# EAGLE design SLaB (EAGLE 9.6.1)
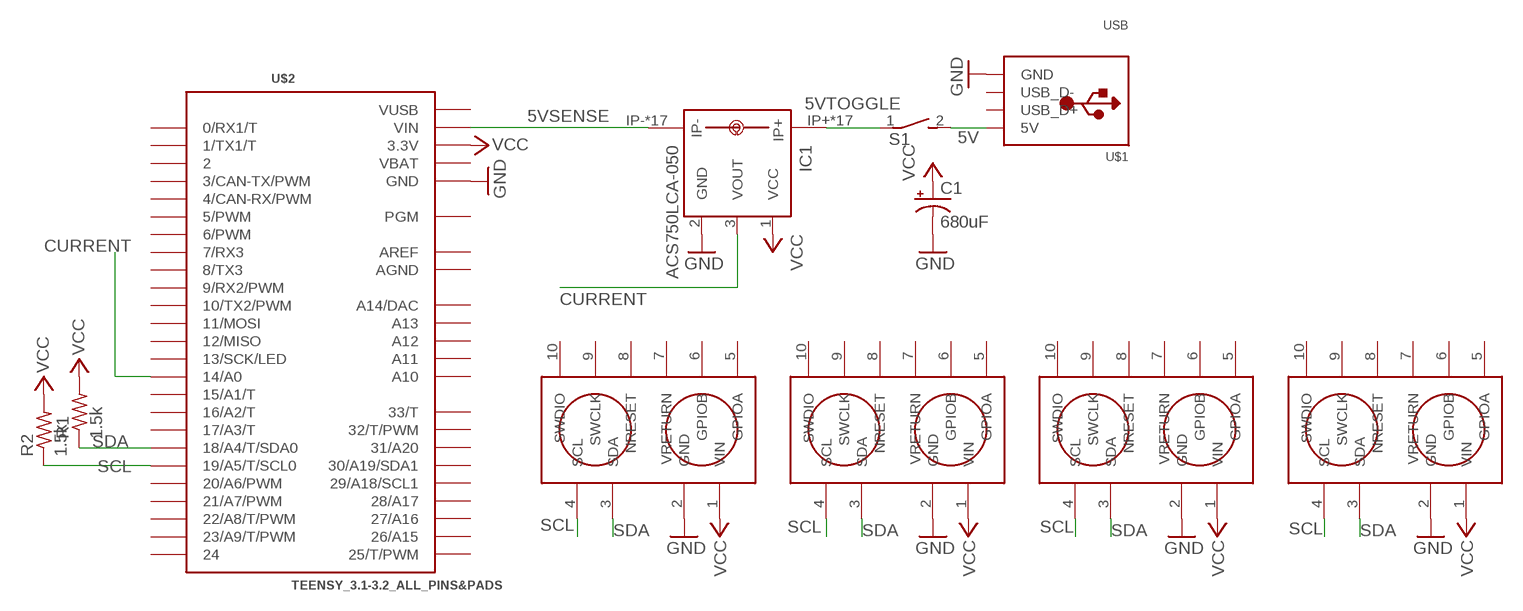
[diagram p0: schematic, sheet 1]

## Parts
C1  680uF  CPOL-USE2-5  [E2-5]
IC1  ACS750LCA-050  [ACS75050]
R1  1.5k  R-US_0204/7  [0204/7]
R2  1.5k  R-US_0204/7  [0204/7]
S1  DS01E  [DS-01]
U$1  USB  [USB]
U$2  TEENSY_3.1-3.2_ALL_PINS&PADS  [TEENSY_3.0-3.2_ALL_PINS_&_PADS]
U$3  LIDAR  [LIDAR]
U$4  LIDAR  [LIDAR]
U$5  LIDAR  [LIDAR]
U$6  LIDAR  [LIDAR]

## Nets
5V: S1.2 U$1.5V
5VSENSE: IC1.IP- IC1.IP-@2(IP-) IC1.IP-@3(IP-) IC1.IP-@4(IP-) IC1.IP-@5(IP-) IC1.IP-@6(IP-) IC1.IP-@7(IP-) IC1.IP-@8(IP-) IC1.IP-@9(IP-) IC1.IP-@10(IP-) IC1.IP-@11(IP-) IC1.IP-@12(IP-) IC1.IP-@13(IP-) IC1.IP-@14(IP-) IC1.IP-@15(IP-) IC1.IP-@16(IP-) IC1.IP-@17(IP-) U$2.VIN
5VTOGGLE: IC1.IP+ IC1.IP+@2(IP+) IC1.IP+@3(IP+) IC1.IP+@4(IP+) IC1.IP+@5(IP+) IC1.IP+@6(IP+) IC1.IP+@7(IP+) IC1.IP+@8(IP+) IC1.IP+@9(IP+) IC1.IP+@10(IP+) IC1.IP+@11(IP+) IC1.IP+@12(IP+) IC1.IP+@13(IP+) IC1.IP+@14(IP+) IC1.IP+@15(IP+) IC1.IP+@16(IP+) IC1.IP+@17(IP+) S1.1
CURRENT: IC1.3(VOUT) U$2.14/A0
GND: C1.- IC1.2(GND) U$1.GND U$2.GND U$2.GND1(GND) U$2.GND2(GND) U$3.2(GND) U$4.2(GND) U$5.2(GND) U$6.2(GND)
SCL: R2.1 U$2.19/A5(19/A5/T/SCL0) U$3.4(SCL) U$4.4(SCL) U$5.4(SCL) U$6.4(SCL)
SDA: R1.1 U$2.18/A4(18/A4/T/SDA0) U$3.3(SDA) U$4.3(SDA) U$5.3(SDA) U$6.3(SDA)
VCC: C1.+ IC1.1(VCC) R1.2 R2.2 U$2.3.3V U$2.3.3V1(3.3V) U$2.3.3V2(3.3V) U$3.1(VIN) U$4.1(VIN) U$5.1(VIN) U$6.1(VIN)
Unconnected: U$1.USB_D+ U$1.USB_D- U$2.0(0/RX1/T) U$2.1(1/TX1/T) U$2.2 U$2.3(3/CAN-TX/PWM) U$2.4(4/CAN-RX/PWM) U$2.5(5/PWM) U$2.6(6/PWM) U$2.7(7/RX3) U$2.8(8/TX3) U$2.9(9/RX2/PWM) U$2.10(10/TX2/PWM) U$2.11(11/MOSI) U$2.12(12/MISO) U$2.13(13/SCK/LED) U$2.15/A1(15/A1/T) U$2.16/A2(16/A2/T) U$2.17/A3(17/A3/T) U$2.20/A6(20/A6/PWM) U$2.21/A7(21/A7/PWM) U$2.22/A8(22/A8/T/PWM) U$2.23/A9(23/A9/T/PWM) U$2.24 U$2.25(25/T/PWM) U$2.26(26/A15) U$2.27(27/A16) U$2.28(28/A17) U$2.29(29/A18/SCL1) U$2.30(30/A19/SDA1) U$2.31(31/A20) U$2.32(32/T/PWM) U$2.33(33/T) U$2.A10 U$2.A11 U$2.A12 U$2.A13 U$2.PGM U$2.RESET/DAC(A14/DAC) U$3.5(GPIOA) U$3.6(GPIOB) U$3.7(VRETURN) U$3.8(NRESET) U$3.9(SWCLK) U$3.10(SWDIO) U$4.5(GPIOA) U$4.6(GPIOB) U$4.7(VRETURN) U$4.8(NRESET) U$4.9(SWCLK) U$4.10(SWDIO) U$5.5(GPIOA) U$5.6(GPIOB) U$5.7(VRETURN) U$5.8(NRESET) U$5.9(SWCLK) U$5.10(SWDIO) U$6.5(GPIOA) U$6.6(GPIOB) U$6.7(VRETURN) U$6.8(NRESET) U$6.9(SWCLK) U$6.10(SWDIO)

## Power pins joined to a net without a drawn wire
AGND: U$2.AGND
AREF: U$2.AREF
VBAT: U$2.VBAT
VUSB: U$2.VUSB

## Library data of the parts
C1 = adafruit:CPOL-US: POLARIZED CAPACITOR, American symbol
IC1 = allegro:ACS750*CA-050: Current Sensor display layer 49 Reference in BRD and place VIAs on circles Source: www.allegromicro.com/datafile/0750-050.pdf; MF: ALLEGRO MICROSYSTEMS, INC.; MPN: ACS750LCA-050; OC_FARNELL: 1457176; OC_NEWARK: 61H4464
R1 R2 = adafruit:R-US_: RESISTOR, American symbol
S1 = switch-dil:DS01E: DIL/CODE SWITCH; OC_FARNELL: unknown; OC_NEWARK: unknown
U$1 = USB:USB
U$2 = Teensy_3_and_LC_Series_Boards_v1.4:TEENSY_3.1-3.2_ALL_PINS&PADS: Footprint for Teensy 3.1 or 3.2 board using all pads and all through-holes. Pads need a 2x7 0.1" SMD header.
U$3-U$6 = LIDAR:LIDAR

## Board
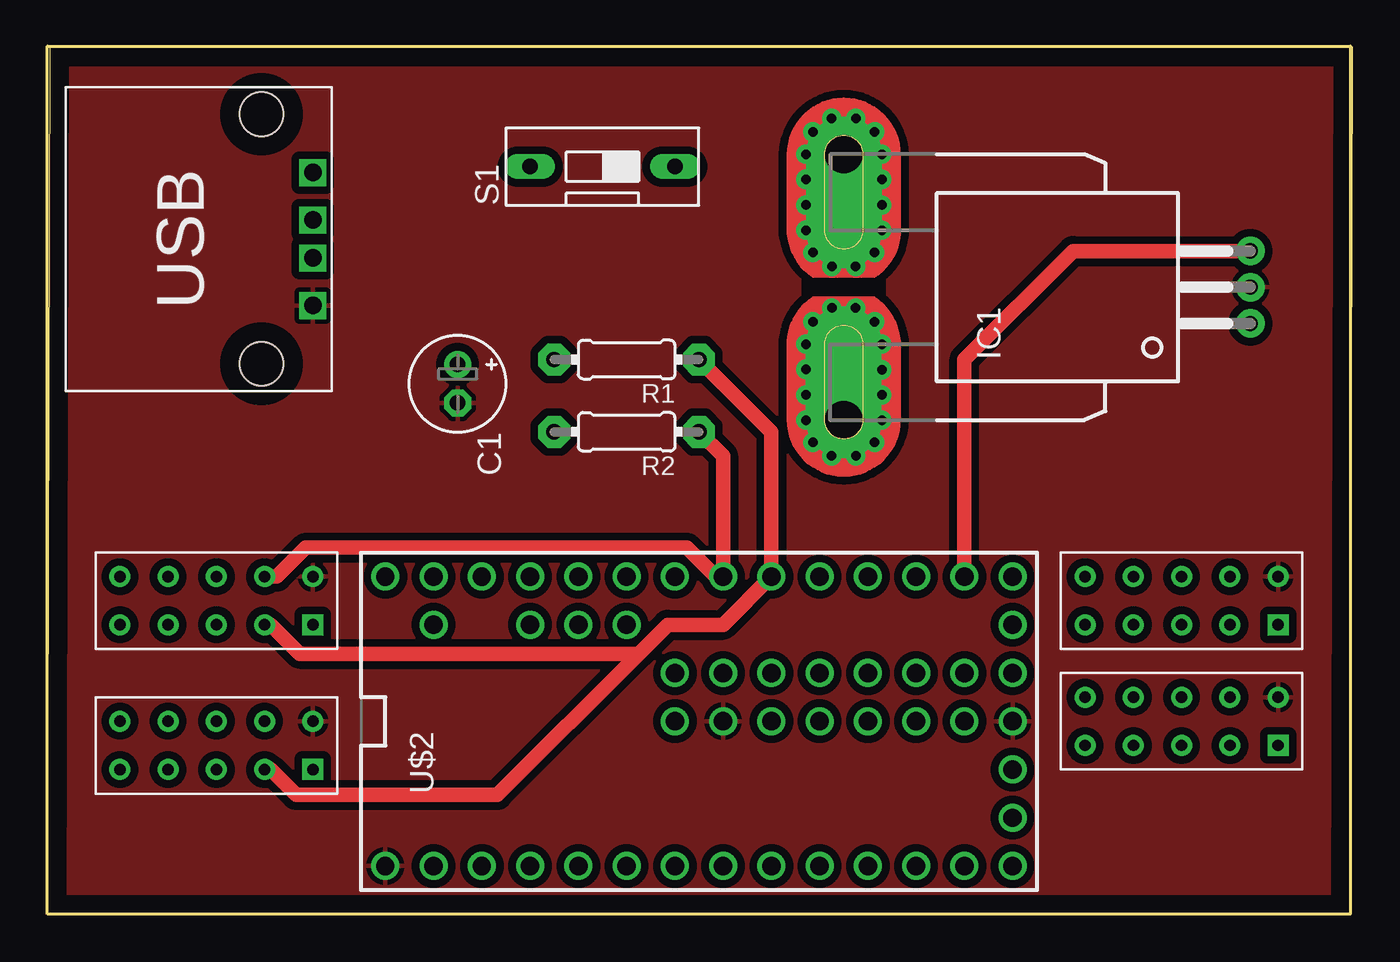
[diagram p1: board, top side]
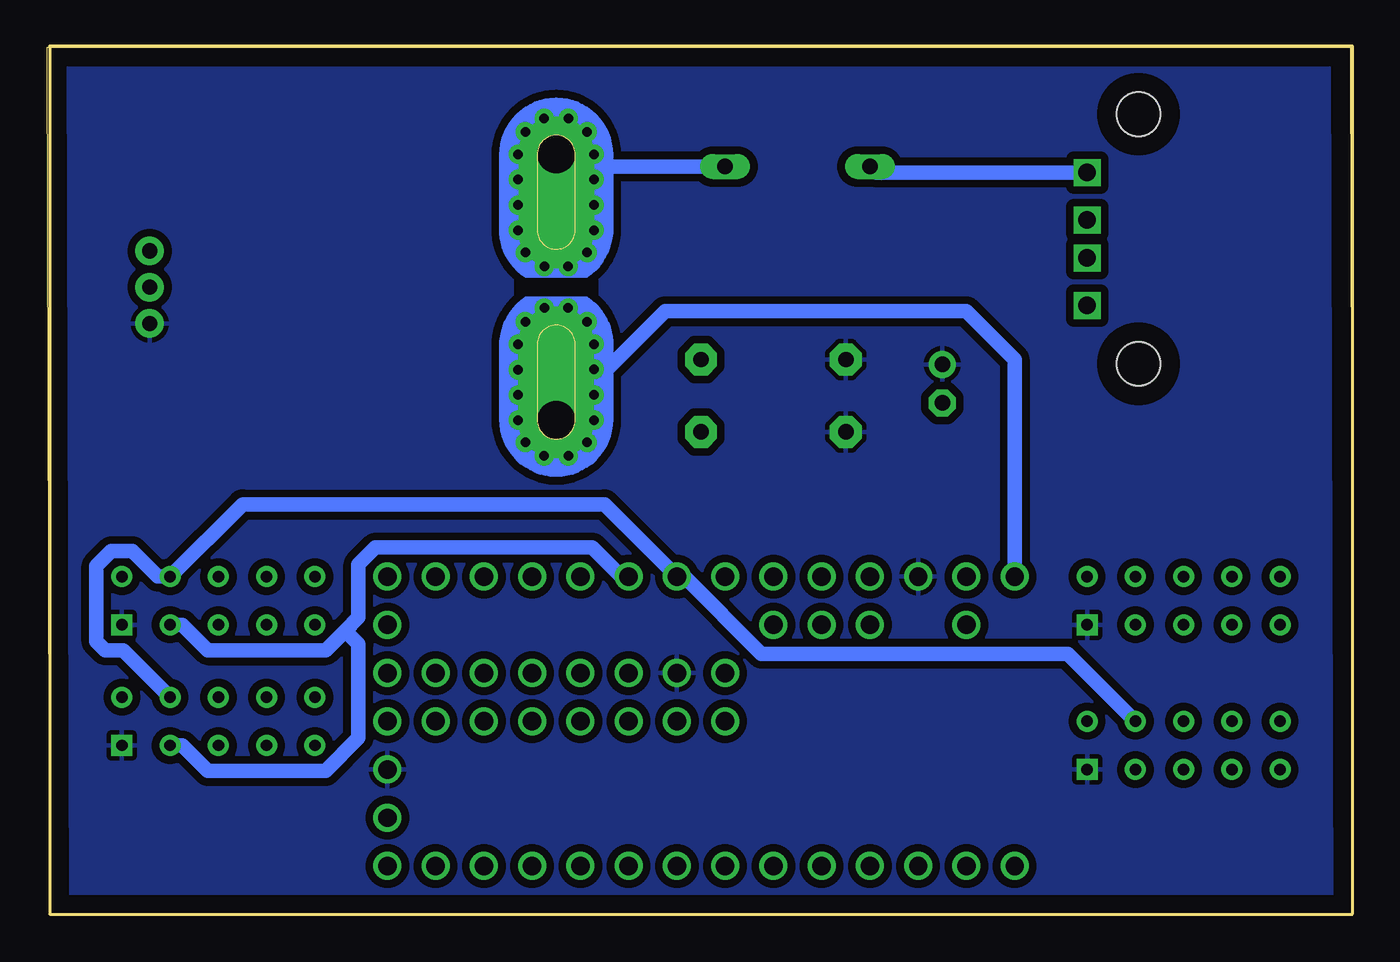
[diagram p2: board, bottom side, seen from below]

Size 68.69 x 45.64 mm. Coordinates in mm from the lower left corner, seen from the top.
Outline: 0,0 68.56,0 68.69,45.64 0.13,45.64 0,0
Copper layers (1*16): Top 0.035mm / dielectric 1.5mm / Bottom 0.035mm
Design rules "default *": minimum track width 30mil, minimum drill 0.35mm, track to track 16mil, track to pad 16mil, pad to pad 16mil, via to via 16mil, smd to smd 6mil, copper to edge 40mil, drill to drill 6mil, minimum pad ring 10mil, minimum via ring 8mil, stop-mask expansion 4mil, vias tented up to drill 0mil, thermal gap 10mil
Milling: 4 lines

### Footprints (pad centres in the part's own frame; a part is rotated, then mirrored left to right if it is on the bottom)
E2-5 = drill 0.813 pad 1.422: + -1.016,0 | drill 0.813 pad 1.422 octagon: - 1.016,0
ACS75050 = drill 0.8 pad 1.5: 1 -1.91,-21.4; 2 0,-21.4; 3 1.91,-21.4 | drill 2 pad 4 offset: IP+ 7,0; IP- -7,0 | drill 0.5 pad 0.9: IP+@2 8.89,-0.635; IP+@3 8.89,0.635; IP+@4 8.175,1.625; IP+@5 7,2; IP+@6 5.675,2; IP+@7 4.325,2; IP+@8 3,2; IP+@9 1.825,1.625; IP+@10 1.1,0.625; IP+@11 1.1,-0.625; IP+@12 1.825,-1.625; IP+@13 3,-2; IP+@14 4.325,-2; IP+@15 5.675,-2; IP+@16 7,-2; IP+@17 8.175,-1.625; IP-@2 -8.89,-0.635; IP-@3 -8.89,0.635; IP-@4 -8.175,1.625; IP-@5 -7,2; IP-@6 -5.675,2; IP-@7 -4.325,2; IP-@8 -3,2; IP-@9 -1.825,1.625; IP-@10 -1.1,0.625; IP-@11 -1.1,-0.625; IP-@12 -1.825,-1.625; IP-@13 -3,-2; IP-@14 -4.35,-2; IP-@15 -5.675,-2; IP-@16 -7,-2; IP-@17 -8.175,-1.625
0204/7 = drill 0.813 pad 1.676 octagon: 1 -3.81,0; 2 3.81,0
DS-01 = drill 0.813 long: 1 0,-3.81; 2 0,3.81
USB = drill 0.92 square: 5V -3.5,0; GND 3.5,0; USB_D+ 1,0; USB_D- -1,0 | hole 2.3: -6.57,-2.71; 6.57,-2.71
TEENSY_3.0-3.2_ALL_PINS_&_PADS = drill 0.965: 0 -7.62,13.97; 1 -7.62,11.43; 2 -7.62,8.89; 3 -7.62,6.35; 3.3V 7.62,11.43; 3.3V1 -2.54,-16.51; 3.3V2 2.54,-1.27; 4 -7.62,3.81; 5 -7.62,1.27; 6 -7.62,-1.27; 7 -7.62,-3.81; 8 -7.62,-6.35; 9 -7.62,-8.89; 10 -7.62,-11.43; 11 -7.62,-13.97; 12 -7.62,-16.51; 13 7.62,-16.51; 14/A0 7.62,-13.97; 15/A1 7.62,-11.43; 16/A2 7.62,-8.89; 17/A3 7.62,-6.35; 18/A4 7.62,-3.81; 19/A5 7.62,-1.27; 20/A6 7.62,1.27; 21/A7 7.62,3.81; 22/A8 7.62,6.35; 23/A9 7.62,8.89; 24 0,-3.81; 25 0,-6.35; 26 0,-8.89; 27 0,-11.43; 28 0,-13.97; 29 2.54,-13.97; 30 2.54,-11.43; 31 2.54,-8.89; 32 2.54,-6.35; 33 2.54,-3.81; A10 5.08,6.35; A11 5.08,3.81; A12 0,1.27; A13 2.54,1.27; AGND 7.62,13.97; AREF 5.08,8.89; GND -7.62,16.51; GND1 0,-16.51; GND2 0,-1.27; PGM 2.54,-16.51; RESET/DAC 5.08,-16.51; VBAT -5.08,-16.51; VIN 7.62,16.51; VUSB 5.08,13.97
LIDAR = drill 0.6 square: 1 1.27,5.08 | drill 0.6: 2 -1.27,5.08; 3 1.27,2.54; 4 -1.27,2.54; 5 1.27,0; 6 -1.27,0; 7 1.27,-2.54; 8 -1.27,-2.54; 9 1.27,-5.08; 10 -1.27,-5.08

### Placement (x,y rotation side)
C1  21.59,27.94 270 top
IC1  41.91,33.02 90 top
R1  30.48,29.21 180 top
R2  30.48,25.4 180 top
S1  29.21,39.37 90 top
U$1  13.97,35.56 270 top
U$2  34.29,10.16 90 top
U$3  8.89,8.89 270 top
U$4  59.69,16.51 270 top
U$5  8.89,16.51 270 top
U$6  59.69,10.16 270 top

### Tracks (layer width: path | path; a pad name or v marks a point on that pad's centre or on a via)
5V
  Bottom 0.762: U$1.5V 25.09,39.06 S1.2
5VSENSE
  Bottom 0.762: IC1.IP- 36.18,31.75 20.32,31.75 17.78,29.21 U$2.VIN
5VTOGGLE
  Bottom 0.762: S1.1 41.26,39.37 IC1.IP+
CURRENT
  Top 0.762: IC1.3 53.98,34.93 48.26,29.21 U$2.14/A0
GND
  pour Top: 0,45.72 68.58,45.72 68.58,0 0,0
SCL
  Top 0.762: R2.1 35.56,24.13 U$2.19/A5 35.17,17.78 33.65,19.3 13.6,19.3 12.07,17.78 U$5.4
  Bottom 0.762: U$3.4 14.99,13.72 31.11,13.72 35.17,17.78 U$2.19/A5 39.37,21.59 58.42,21.59 U$4.4 62.87,17.78 64.21,19.12 65.33,19.12 66.11,18.34 66.11,14.36 65.65,13.9 64.7,13.9 U$6.4
SDA
  Top 0.762: R1.1 38.1,25.4 U$2.18/A4 35.56,15.24 32.63,15.24 31.11,13.72 | U$5.3 11.75,15.24 13.27,13.72 31.11,13.72 | U$3.3 11.75,7.62 13.09,6.28 23.67,6.28 31.11,13.72
  Bottom 0.762: U$4.3 61.59,15.24 60.25,13.9 54.05,13.9 53.03,14.93 | 53.03,14.93 52.32,15.63 52.32,18.41 51.43,19.3 40.01,19.3 38.48,17.78 U$2.18/A4 | U$6.3 61.59,8.89 60.25,7.55 54.05,7.55 52.32,9.28 52.32,14.22 53.03,14.93
VCC
  pour Bottom: 0,45.72 68.58,45.72 68.58,0 0,0